# EAGLE board d-cube (EAGLE 9.2.1)
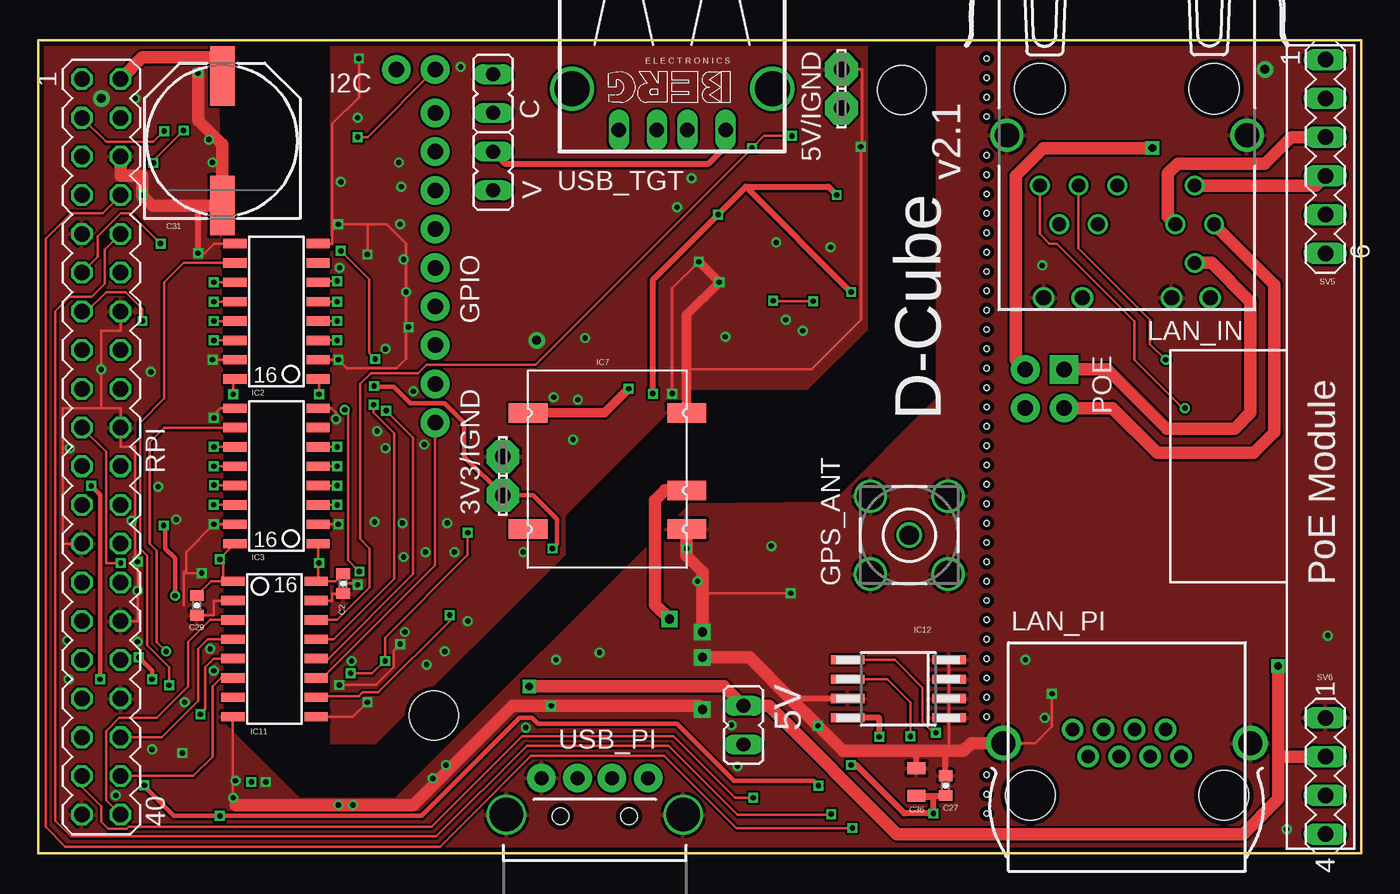
[diagram p4: board, top side]
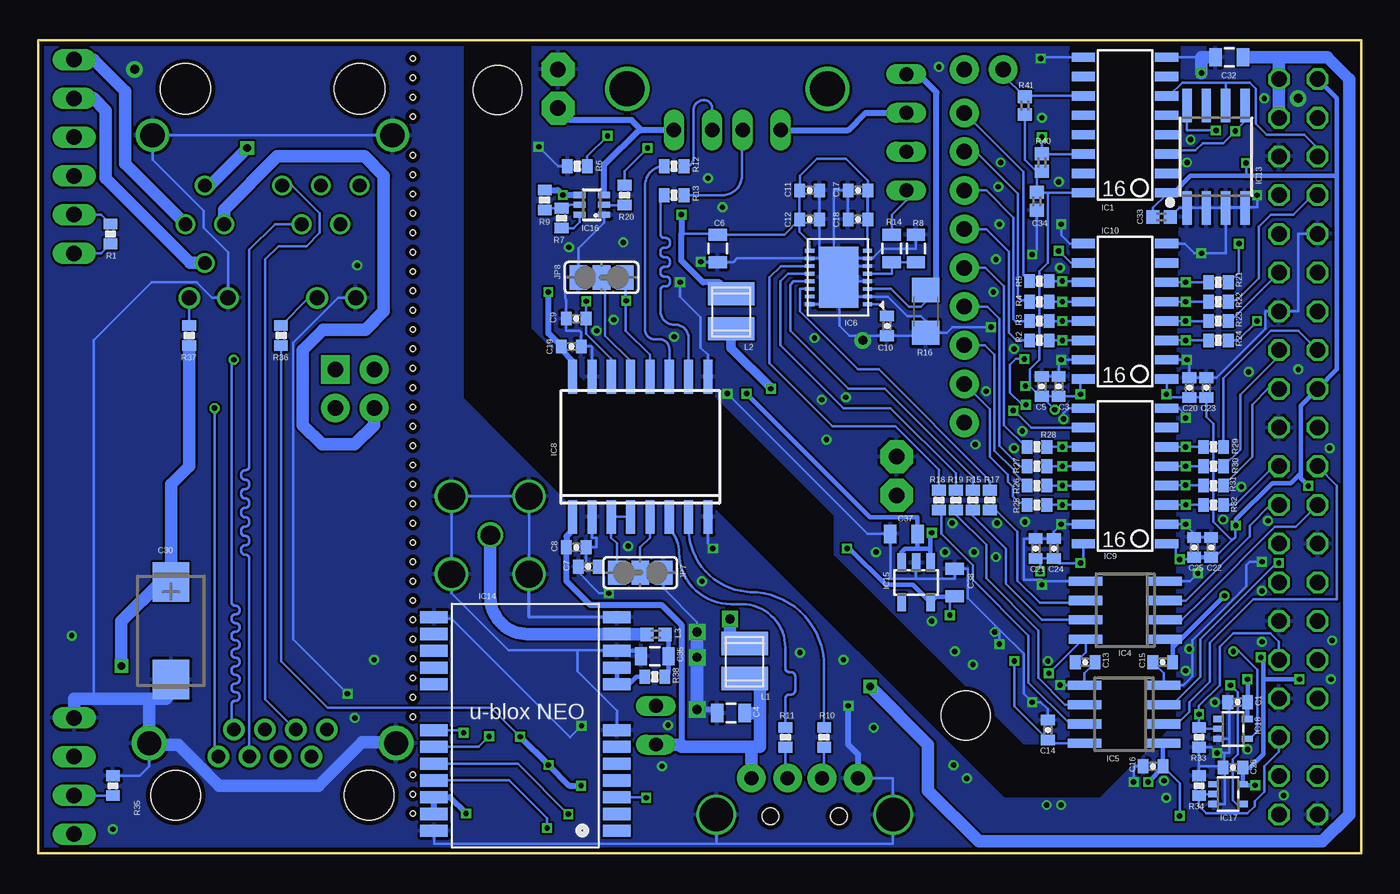
[diagram p5: board, bottom side, seen from below]

Size 86.82 x 53.33 mm. Coordinates in mm from the lower left corner, seen from the top.
Outline: 0,0 86.82,0 86.82,53.33 0,53.33 0,0
Copper layers (1*16): Top 0.035mm / dielectric 1.5mm / Bottom 0.035mm
Design rules "PCB-POOL Standard": minimum track width 0.15mm, minimum drill 0.3mm, track to track 0.15mm, track to pad 0.15mm, pad to pad 0.15mm, via to via 0.15mm, smd to smd 0.15mm, copper to edge 0.3mm, drill to drill 0.2mm, minimum pad ring 0.2mm, minimum via ring 0.15mm, stop-mask expansion 0.075mm, vias tented up to drill 0mil, thermal gap 0.2mm
Holes 3.2 mm at 56.67,50.09 25.96,9.05
Holes 0.35 mm at 62.23,36.91 62.23,38.18 62.23,39.45 62.23,40.72 62.23,41.99 62.23,43.26 62.23,44.53 62.23,45.8 62.23,48.34 62.23,49.61 62.23,50.88 62.23,52.15 62.23,35.64 62.23,34.37 62.23,33.1 62.23,31.83 62.23,30.56 62.23,29.29 62.23,28.02 62.23,26.75 62.23,25.48 62.23,24.21 62.23,22.94 62.23,21.67 62.23,20.4 62.23,19.13 62.23,17.86 62.23,16.59 62.23,15.32 62.23,14.05 62.23,12.78 62.23,11.51 62.23,10.24 62.23,8.97 62.23,5.16 62.23,3.89 62.23,2.62

## Footprints (pad centres in the part's own frame; a part is rotated, then mirrored left to right if it is on the bottom)
JP1 = drill 0.914 long: 1 0,-1.27; 2 0,1.27
0402-CAP = smd 0.7 x 0.9: 1 -0.65,0; 2 0.65,0
0805 = smd 0.8 x 1.2: 1 -0.9,0; 2 0.9,0
CT7343 = smd 2.6 x 2.4: + -3.2,0; - 3.2,0
PANASONIC_G = smd 3.9 x 1.6: + 4.25,0; - -4.25,0
0402 = smd 0.85 x 0.9: 1 -0.58,0; 2 0.58,0
1X09_NO_SILK = drill 1.016 pad 1.88: 1 0,0; 2 2.54,0; 3 5.08,0; 4 7.62,0; 5 10.16,0; 6 12.7,0; 7 15.24,0; 8 17.78,0; 9 20.32,0
BU-SMA-V = drill 1.27: 1 0,0 | drill 1.778: 2 -2.55,2.55; 3 2.55,2.55; 4 2.55,-2.55; 5 -2.55,-2.55
1X02_NO_SILK = drill 1.016 pad 1.88: 1 0,0; 2 2.54,0
SO-16 = smd 0.61 x 1.524: 1 -4.445,-2.794; 2 -3.175,-2.794; 3 -1.905,-2.794; 4 -0.635,-2.794; 5 0.635,-2.794; 6 1.905,-2.794; 7 3.175,-2.794; 8 4.445,-2.794; 9 4.445,2.667; 10 3.175,2.667; 11 1.905,2.667; 12 0.635,2.667; 13 -0.635,2.667; 14 -1.905,2.667; 15 -3.175,2.667; 16 -4.445,2.667
SO-08 = smd 0.6 x 2.2: 1 -1.905,-2.6; 2 -0.635,-2.6; 3 0.635,-2.6; 4 1.905,-2.6; 5 1.905,2.6; 6 0.635,2.6; 7 -0.635,2.6; 8 -1.905,2.6
WSON-16 = smd 0.25 x 0.6: 1 -1.75,-1.9; 2 -1.25,-1.9; 3 -0.75,-1.9; 4 -0.25,-1.9; 5 0.25,-1.9; 6 0.75,-1.9; 7 1.25,-1.9; 8 1.75,-1.9; 9 1.75,1.9; 10 1.25,1.9; 11 0.75,1.9; 12 0.25,1.9; 13 -0.25,1.9; 14 -0.75,1.9; 15 -1.25,1.9; 16 -1.75,1.9 | smd 4 x 2.6: 17 0,0
NXE2 = smd 1.27 x 2.54: 1 2.54,0; 3 5.08,0; 7 10.16,0; 8 10.16,10.414; 14 2.54,10.414
SO-16W = smd 0.6 x 2.2: 1 -4.445,-4.6; 2 -3.175,-4.6; 3 -1.905,-4.6; 4 -0.635,-4.6; 5 0.635,-4.6; 6 1.905,-4.6; 7 3.175,-4.6; 8 4.445,-4.6; 9 4.445,4.6; 10 3.175,4.6; 11 1.905,4.6; 12 0.635,4.6; 13 -0.635,4.6; 14 -1.905,4.6; 15 -3.175,4.6; 16 -4.445,4.6
SO-08M = smd 0.6 x 2.2: 1 -1.905,-3.33; 2 -0.635,-3.33; 3 0.635,-3.33; 4 1.905,-3.33; 5 1.905,3.33; 6 0.635,3.33; 7 -0.635,3.33; 8 -1.905,3.33
SO08-EIAJ = smd 0.61 x 2.21: 1 -1.905,-3.378; 2 -0.635,-3.378; 3 0.635,-3.378; 4 1.905,-3.378; 5 1.905,3.353; 6 0.635,3.353; 7 -0.635,3.353; 8 -1.905,3.353
NEO-M8 = smd 1.8 x 0.8: 1 6.4,-7.4; 2 6.4,-6.3; 3 6.4,-5.2; 4 6.4,-4.1; 5 6.4,-3; 6 6.4,-1.9; 7 6.4,-0.8; 8 6.4,2.2; 9 6.4,3.3; 10 6.4,4.4; 11 6.4,5.5; 12 6.4,6.6; 13 -5.6,6.6; 14 -5.6,5.5; 15 -5.6,4.4; 16 -5.6,3.3; 17 -5.6,2.2; 18 -5.6,-0.8; 19 -5.6,-1.9; 20 -5.6,-3; 21 -5.6,-4.1; 22 -5.6,-5.2; 23 -5.6,-6.3; 24 -5.6,-7.4
SOT23-5-DBV = smd 0.55 x 1.2: 1 -0.95,-1.3; 2 0,-1.3; 3 0.95,-1.3; 4 0.95,1.3; 5 -0.95,1.3
SOT-363 = smd 0.4 x 0.8: 1 -0.65,-0.8; 2 0,-0.8; 3 0.65,-0.8; 4 0.65,0.8; 5 0,0.8; 6 -0.65,0.8
SOT353 = smd 0.42 x 0.7: 1 -0.65,-0.95; 2 0,-0.95; 3 0.65,-0.95; 4 0.65,0.95; 5 -0.65,0.95
PAD-JUMPER-3-2OF3_NC_BY_TRACE_YES_SILK_LARGE = smd 1.168 x 1.6: 1 -1.524,0; 2 0,0; 3 1.524,0
8200 = smd 3.05 x 1.52: P$1 1.525,0.76; P$2 1.525,3.05
POE = drill 0.9 pad 1.3: 1 5.715,0; 2 4.445,2.54; 3 3.175,0; 4 1.905,2.54; 5 0.635,0; 8 -3.175,2.54; 9 -4.445,0; 10 -5.715,2.54; 11 -4.445,5.08 | drill 1 pad 1.422: G+ -5.465,7.37; G- -2.925,7.37; Y+ 2.925,7.37; Y- 5.465,7.37 | drill 1.6 pad 2.184: M1 -7.875,-3.3; M2 7.875,-3.3 | hole 3.3: 5.715,-6.35; -5.715,-6.35
0446200002 = drill 0.889 pad 1.422: 1 3.556,2.54; 2 2.54,4.318; 3 1.524,2.54; 4 0.508,4.318; 5 -0.508,2.54; 6 -1.524,4.318; 7 -2.54,2.54; 8 -3.556,4.318 | drill 1.575 pad 2.286: S@1 -8.103,3.429; S@2 8.103,3.429 | hole 3.251: 6.35,0; -6.35,0
2X02_NO_SILK = drill 1.016 pad 1.88 square: 1 0,0 | drill 1.016 pad 1.88: 2 2.54,0; 3 0,-2.54; 4 2.54,-2.54
0402-RES = smd 0.7 x 0.9: 1 -0.65,0; 2 0.65,0
1206 = smd 1.6 x 1.8: 1 -1.4,0; 2 1.4,0
MA20-2 = drill 1.016 octagon: 1 -24.13,-1.27; 2 -24.13,1.27; 3 -21.59,-1.27; 4 -21.59,1.27; 5 -19.05,-1.27; 6 -19.05,1.27; 7 -16.51,-1.27; 8 -16.51,1.27; 9 -13.97,-1.27; 10 -13.97,1.27; 11 -11.43,-1.27; 12 -11.43,1.27; 13 -8.89,-1.27; 14 -8.89,1.27; 15 -6.35,-1.27; 16 -6.35,1.27; 17 -3.81,-1.27; 18 -3.81,1.27; 19 -1.27,-1.27; 20 -1.27,1.27; 21 1.27,-1.27; 22 1.27,1.27; 23 3.81,-1.27; 24 3.81,1.27; 25 6.35,-1.27; 26 6.35,1.27; 27 8.89,-1.27; 28 8.89,1.27; 29 11.43,-1.27; 30 11.43,1.27; 31 13.97,-1.27; 32 13.97,1.27; 33 16.51,-1.27; 34 16.51,1.27; 35 19.05,-1.27; 36 19.05,1.27; 37 21.59,-1.27; 38 21.59,1.27; 39 24.13,-1.27; 40 24.13,1.27
MA06-1 = drill 1.016 long: 1 -6.35,0; 2 -3.81,0; 3 -1.27,0; 4 1.27,0; 5 3.81,0; 6 6.35,0
MA04-1 = drill 1.016 long: 1 -3.81,0; 2 -1.27,0; 3 1.27,0; 4 3.81,0
LSP10 = drill 1.016 pad 2.159 octagon: MP 0,0
USB-A-H = drill 0.914 pad 1.88: D+ 2.4,1.127; D- 2.4,-1.127; GND 2.4,3.5; VBUS 2.4,-3.5 | drill 2.2: GND2 0,-5.8; GND3 0,5.8 | hole 1.1: -0.1,2.25; -0.1,-2.25
PN87520-S = drill 0.95 long: 1 -3.5,2.71; 2 -1,2.71; 3 1,2.71; 4 3.5,2.71 | drill 2.3 pad 2.9: S1 -6.57,0; S2 6.57,0

## Placement (x,y rotation side)
5V  [JP1]  46.28,8.41 180 top
C  [JP1]  29.84,49.85 0 top
C1  0.1u  [0402-CAP]  8.1,9.92 180 bottom
C2  0.1u  [0402-CAP]  20,17.7 270 top
C3  0.1u  [0402-CAP]  19.84,30.64 90 bottom
C4  4u7  [0805]  41.35,9.21 180 bottom
C5  0.1u  [0402-CAP]  20.95,30.64 90 bottom
C6  10u  [0805]  42.23,39.69 270 bottom
C7  0.1u  [0402-CAP]  50.72,18.81 180 bottom
C8  0.1u  [0402-CAP]  51.51,20.08 0 bottom
C9  0.1u  [0402-CAP]  51.51,35.08 180 bottom
C10  1u  [0402-CAP]  31.11,34.61 270 bottom
C11  0.1u  [0402-CAP]  36.2,43.5 0 bottom
C12  10p  [0402-CAP]  36.2,41.59 0 bottom
C13  0.1u  [0402-CAP]  18.1,12.54 0 bottom
C14  0.1u  [0402-CAP]  20.56,8.1 90 bottom
C15  0.1u  [0402-CAP]  13.02,12.54 180 bottom
C16  0.1u  [0402-CAP]  13.65,5.71 180 bottom
C17  0.1u  [0402-CAP]  33.02,43.5 180 bottom
C18  10p  [0402-CAP]  33.02,41.59 180 bottom
C19  0.1u  [0402-CAP]  51.83,33.26 0 bottom
C20  0.1u  [0402-CAP]  11.27,30.56 90 bottom
C21  0.1u  [0402-CAP]  21.35,20 90 bottom
C22  0.1u  [0402-CAP]  9.84,20.08 90 bottom
C23  0.1u  [0402-CAP]  10.16,30.56 90 bottom
C24  0.1u  [0402-CAP]  20.16,20 90 bottom
C25  0.1u  [0402-CAP]  10.95,20.08 90 bottom
C26  0.1u  [0402-CAP]  8.41,5.64 180 bottom
C27  0.1u  [0402-CAP]  59.53,4.45 90 top
C29  0.1u  [0402-CAP]  10.4,16.27 270 top
C30  470u  [CT7343]  78.11,14.61 270 bottom
C31  1000uF  [PANASONIC_G]  12.06,46.75 90 top
C32  0.1u  [0805]  8.65,52.23 180 bottom
C33  0.1uF  [0402]  13.1,41.75 0 bottom
C34  0.1uF  [0402]  21.27,42.78 270 bottom
C35  10n  [0805]  46.35,12.94 180 bottom
C36  10uF  [0805]  57.63,4.68 90 top
C37  1.0uF  [0805]  30,20.95 180 bottom
C38  1.0uF  [0805]  26.67,17.78 90 bottom
GPIO  [1X09_NO_SILK]  26.04,48.58 270 top
GPS_ANT  BU-SMA-V  [BU-SMA-V]  57.15,20.88 0 top
I2C  [1X02_NO_SILK]  23.5,51.44 0 top
IC1  SI8605  [SO-16]  15.56,47.78 90 bottom
IC2  SI8640AB-B-IS1  [SO-16]  15.56,35.56 90 top
IC3  SI8640AB-B-IS1  [SO-16]  15.56,24.77 90 top
IC4  ISO7220M  [SO-08]  15.48,15.95 90 bottom
IC5  ISO7221M  [SO-08]  15.56,9.13 90 bottom
IC6  [WSON-16]  34.29,37.78 90 bottom
IC7  NXE2  [NXE2]  42.55,18.73 90 top
IC8  ADUM3160  [SO-16W]  47.31,26.67 0 bottom
IC9  SI8640AB-B-IS1  [SO-16]  15.56,24.77 90 bottom
IC10  SI8640AB-B-IS1  [SO-16]  15.56,35.56 90 bottom
IC11  SI8640AB-B-IS1  [SO-16]  15.56,13.41 270 top
IC12  24AA32ASM  [SO-08M]  56.44,10.79 90 top
IC13  I2C EEPROM  [SO08-EIAJ]  9.53,45.72 0 bottom
IC14  NEO-M8  [NEO-M8]  55.24,8.89 0 bottom
IC15  MIC550X-YM5  [SOT23-5-DBV]  29.21,17.78 180 bottom
IC16  COMPLEMENTARY  [SOT-363]  50.48,42.55 90 bottom
IC17  74LVC1G04  [SOT353]  8.73,3.89 270 bottom
IC18  74LVC1G04  [SOT353]  8.41,8.18 270 bottom
JP7  JUMPER-PAD-3-2OF3_NC_BY_TRACE_LARGE  [PAD-JUMPER-3-2OF3_NC_BY_TRACE_YES_SILK_LARGE]  47.31,18.41 180 bottom
JP8  JUMPER-PAD-3-2OF3_NC_BY_TRACE_LARGE  [PAD-JUMPER-3-2OF3_NC_BY_TRACE_YES_SILK_LARGE]  49.85,37.78 0 bottom
L1  820082153C  [8200]  41.99,10.72 0 bottom
L2  820082223C  [8200]  42.86,33.66 0 bottom
L3  27nH  [0402]  46.28,14.37 0 bottom
LAN_IN  SI-52008-F  [POE]  71.44,43.81 180 top
LAN_PI  0446200002  [0446200002]  71.44,3.81 0 top
POE  [2X02_NO_SILK]  67.31,31.75 270 top
R1  10k  [0402-RES]  82.07,40.64 90 bottom
R2  100k  [0402-RES]  21.11,33.66 180 bottom
R3  100k  [0402-RES]  21.11,34.92 180 bottom
R4  100k  [0402-RES]  21.11,36.2 180 bottom
R5  100k  [0402-RES]  21.11,37.54 180 bottom
R6  10k  [0402-RES]  51.44,45.09 0 bottom
R7  10k  [0402-RES]  52.47,41.67 90 bottom
R8  10k  [0805]  29.21,39.69 270 bottom
R9  100k  [0402-RES]  53.58,42.86 90 bottom
R10  24  [0402-RES]  35.24,7.62 270 bottom
R11  24  [0402-RES]  37.78,7.62 270 bottom
R12  24  [0402-RES]  45.09,45.09 0 bottom
R13  24  [0402-RES]  45.09,43.18 0 bottom
R14  46k4  [0805]  30.8,39.69 90 bottom
R15  33  [0402-RES]  25.48,23.18 270 bottom
R16  0.51  [1206]  28.57,35.56 90 bottom
R17  33  [0402-RES]  24.37,23.18 270 bottom
R18  33  [0402-RES]  27.7,23.18 270 bottom
R19  33  [0402-RES]  26.59,23.18 270 bottom
R20  100  [0402-RES]  48.34,43.18 270 bottom
R21  100  [0402-RES]  9.37,37.47 0 bottom
R22  100  [0402-RES]  9.37,36.2 0 bottom
R23  100  [0402-RES]  9.37,34.92 0 bottom
R24  100  [0402-RES]  9.37,33.66 0 bottom
R25  100k  [0402-RES]  21.27,22.86 180 bottom
R26  100k  [0402-RES]  21.27,24.13 180 bottom
R27  100k  [0402-RES]  21.27,25.4 180 bottom
R28  100k  [0402-RES]  21.27,26.67 180 bottom
R29  100  [0402-RES]  9.68,26.67 0 bottom
R30  100  [0402-RES]  9.68,25.4 0 bottom
R31  100  [0402-RES]  9.68,24.13 0 bottom
R32  100  [0402-RES]  9.68,22.86 0 bottom
R33  10k  [0402-RES]  10.64,7.62 90 bottom
R34  10k  [0402-RES]  10.64,4.45 270 bottom
R35  100k  [0402-RES]  81.92,4.45 90 bottom
R36  220  [0402-RES]  70.88,33.97 90 bottom
R37  470  [0402-RES]  76.91,33.97 90 bottom
R38  10  [0402-RES]  46.35,11.59 180 bottom
R40  100k  [0402]  20.95,45.32 270 bottom
R41  100k  [0402]  22.07,49.05 270 bottom
RPI  [MA20-2]  4.13,26.67 270 top
SV5  [MA06-1]  84.45,45.72 270 top
SV6  [MA04-1]  84.45,5.08 270 top
TP_3V3  LSP10  [LSP10]  30.48,23.5 90 top
TP_IGND  LSP10  [LSP10]  52.7,51.44 90 top
TP_IGND1  LSP10  [LSP10]  30.48,26.04 90 top
TP_VCC  LSP10  [LSP10]  52.7,48.9 90 top
U$1  [TU-LOGO-SMALL]  67.23,20.32 90 top
U$2  [TU-LOGO-SMALL]  67.23,20.8 270 bottom
USB_PI  USB+SHIELDUSB-A-H-S  [USB-A-H]  36.51,2.54 90 top
USB_TGT  PN87520-S  [PN87520-S]  41.59,50.16 180 top
V  [JP1]  29.84,44.77 180 top

## Tracks (layer width: path | path; a pad name or v marks a point on that pad's centre or on a via)
!EN_BLOCK1  (via drill 0.35)
  Top 0.152: v8.57,11.03 8.57,12.22 7.14,13.65 7.14,19.53 6.67,20 6.67,28.26 8.26,29.84 8.26,37.47 9.53,38.73 IC2.10
  Bottom 0.152: IC17.4 7.78,3.17 8.1,3.17 8.41,3.49 8.41,6.19 8.1,6.51 8.1,10.56 v8.57,11.03
!EN_BLOCK2  (via drill 0.35)
  Top 0.152: v8.38,13.26 7.78,13.86 7.78,19.84 7.3,20.32 7.3,26.99 8.26,27.94 IC3.10
  Bottom 0.152: IC18.4 7.32,7.53 6.83,8.02 6.83,12.06 8.02,13.26 v8.38,13.26
+3V3  (via drill 0.35)
  Top 0.152: IC3.16 11.91,19.34 v11.91,19.29 12.13,19.29 12.13,17.86 IC11.1 11.34,17.86 C29.1 | v12.78,30.12 12.78,31 IC2.16 | v9.53,47.43 7.54,45.44 v7.54,45.3
  Top 0.305: v8.97,16.91 8.97,19.37 8.33,20 8.33,21.4 v8.23,21.51 | v7.46,11.43 7.46,11.99 v6.59,12.86 | v51.2,4.45 50.88,4.76 45.64,4.76 41.91,8.49 32.78,8.49 32.38,8.89 31.59,8.89 25.16,2.46 v11.91,2.46 8.89,2.46 6.96,4.39 v6.96,4.47 | v4.05,11.43 4.05,23.53 v3.47,24.11
  Top 0.406: v55.18,7.65 55.18,8.89 IC12.8 | v53.33,5.8 53.65,5.8 56.83,2.62 v58.74,2.62 58.74,3.73 57.63,3.73 C36.1 59.52,3.78 C27.1
  Bottom 0.152: IC9.1 12.14,20.32 12.14,19.53 v11.91,19.29 11.1,19.29 C25.1 | C22.1 9.59,19.43 8.48,20.54 | 8.48,20.54 8.27,20.76 8.27,21.47 v8.23,21.51 | IC10.1 12.76,30.14 v12.78,30.12 12.56,29.91 C20.1 C23.1 10.16,28.65 9.68,28.18 9.68,21.75 8.48,20.54 | IC13.8 11.43,47.43 v9.53,47.43 | v7.54,45.3 7.54,44.53 7.62,44.45 | R36.1 70.88,12.62 67.82,9.56 57.09,9.56 v55.18,7.65 | C33.1 13.68,42.34 12.76,43.26 IC1.1 | C16.1 11.91,4.62 v11.91,2.46
  Bottom 0.305: 1.59,44.45 1.59,31.75 RPI.17 3.97,29.37 3.97,24.92 | 1.59,44.45 1.59,49.53 RPI.1 | 6.43,11.43 6.43,12.7 v6.59,12.86 | 6.43,11.43 6.43,6.51 7.3,5.64 C26.1 7.76,4.56 | IC17.5 7.76,4.56 | IC18.5 7.46,9.9 C1.1 7.45,11.41 v7.46,11.43 | C25.1 C22.1 | IC4.1 12.37,14.05 C15.1 12.37,13.51 v8.97,16.91 | v13.97,4.68 13,5.65 C16.1 13,7.18 IC5.1 | 3.97,24.92 4.6,24.29 5.84,24.29 8.23,21.91 v8.23,21.51 | 1.59,44.45 7.62,44.45 11.19,44.45 12.3,43.34 IC1.1 | v6.96,4.47 7.68,4.47 7.76,4.56 | 6.43,11.43 v4.05,11.43 | v3.47,24.11 3.97,24.61 3.97,24.92
  Bottom 0.406: v51.2,4.45 51.98,4.45 v53.33,5.8 v55.18,7.65 | IC14.23 IC14.22 59.81,3.69 v58.74,2.62
+5V  (via drill 0.5)
  Top 0.813: v32.23,10.95 45.01,10.95 5V.1 47.94,9.68 56.36,1.27 79.06,1.27 81.36,3.57 81.36,6.35 | 81.36,6.35 v81.36,12.3 | SV6.2 81.36,6.35 | RPI.2 6.83,52.23 11.79,52.23 12.06,51.95 C31.+
  Bottom 0.813: RPI.4 RPI.2 5.4,52.15 5.32,52.23 | 5.32,52.23 2.22,52.23 0.79,50.8 0.79,2.54 2.54,0.79 25.08,0.79 28.42,4.13 28.42,7.14 v32.23,10.95 | v81.36,12.3 81.36,15.24 78.79,17.8 C30.+ 78.11,24.21 76.91,25.4 R37.1 | 5.32,52.23 C32.1
A_CSB
  Bottom 0.152: IC6.14 36.83,37.03 36.83,35.56 33.02,31.75 31.66,31.75 24.37,24.46 R17.1
A_SCLK
  Bottom 0.152: IC6.13 37.24,37.53 37.47,37.31 37.47,34.29 33.66,30.48 31.26,30.48 25.48,24.7 R15.1
A_SDI
  Bottom 0.152: IC6.12 37.61,38.03 38.1,37.54 38.1,33.34 33.97,29.21 30.88,29.21 26.59,24.92 R19.1
A_SDO
  Bottom 0.152: IC6.11 38.06,38.53 38.81,37.78 38.81,32.15 34.69,28.02 30.56,28.02 27.7,25.16 R18.1
B1C1  (via drill 0.35)
  Top 0.152: RPI.11 3.89,39.13 3.89,40.48 5.4,41.99 6.03,41.99 v8.02,40.01
  Bottom 0.152: R21.2 8.64,37.47 8.02,38.09 v8.02,40.01
B1C2
  Bottom 0.152: RPI.7 3.17,43.18 4.46,41.89 5.94,41.89 6.73,41.11 6.73,37.72 8.16,36.29 8.72,36.29 R22.2
B1C3
  Bottom 0.152: RPI.12 8.57,34.92 R23.2
B1C4  (via drill 0.35)
  Top 0.152: RPI.13 3.17,35.56 4.45,36.83 5.71,36.83 6.83,35.72 v6.83,34.92
  Bottom 0.152: R24.2 8.1,33.66 v6.83,34.92
B2C1
  Bottom 0.152: RPI.15 4.13,34.29 5.92,34.29 9.03,31.18 R29.2
B2C2
  Bottom 0.152: RPI.16 5.4,32.62 7.94,30.08 7.94,26.5 R30.2
B2C3
  Bottom 0.152: R31.2 7.14,26.02 7.14,29.45 6.11,30.48 RPI.18
B2C4
  Bottom 0.152: RPI.22 5.71,25.4 8.26,22.86 R32.2
BSCL
  Bottom 0.152: IC1.11 22.01,49.69 R41.1 23.5,51.06 I2C.1
BSDA  (via drill 0.35)
  Top 0.152: I2C.2 21.59,46.99 v20.95,46.99
  Bottom 0.152: IC1.14 20.93,45.88 R40.1 v20.95,46.99
CP1
  Bottom 0.152: SV5.5 82.69,41.91 R1.2
CP2
  Bottom 0.152: SV5.6 82.69,39.37 R1.1
CSB
  Bottom 0.152: IC4.3 11.51,16.59 7.3,20.8 7.3,21.51 5.95,22.86 RPI.24
D+_OUT
  Bottom 0.152: R13.1 45.98,42.93 45.98,40.64 arc-90 45.72,40.38 45.63,40.38 arc90 45.36,40.11 45.36,40.01 arc90 45.63,39.74 45.72,39.74 arc-90 45.98,39.48 45.98,39.37 arc-90 45.72,39.11 45.63,39.11 arc90 45.36,38.85 45.36,38.74 arc90 45.63,38.48 45.72,38.48 arc-90 45.98,38.21 45.98,38.11 arc-90 45.72,37.84 45.63,37.84 arc90 45.36,37.58 45.36,37.47 arc90 45.63,37.21 45.72,37.21 arc-90 45.98,36.95 45.98,35.59 arc-90 45.09,34.69 45.01,34.69 arc90 44.13,33.81 IC8.10
D+_OUT_TERM
  Bottom 0.152: USB_TGT.3 40.64,47.41 40.64,44.45 arc90 41.91,43.18 R13.2
D-_OUT
  Bottom 0.152: R12.1 arc-90 46.99,43.83 46.99,34.37 arc-90 46.35,33.73 46.04,33.73 arc90 45.4,33.1 IC8.11
D-_OUT_TERM
  Bottom 0.152: USB_TGT.2 42.59,48.9 arc-90 43.12,49.43 arc-90 43.81,48.74 43.81,45.56 arc90 44.29,45.09 R12.2
EN_BLOCK1
  Top 0.152: IC11.4 11.11,14.05 10.48,13.41 10.48,10 8.1,7.62 RPI.36
  Bottom 0.152: IC17.2 10.54,3.89 R34.2 10.64,3.1 10.16,2.62 7.46,2.62 6.99,3.1 6.99,3.41 6.35,4.05 6.35,5.71 5.4,6.67 RPI.36
EN_BLOCK2  (via drill 0.35)
  Top 0.152: IC11.5 11.51,12.78 10.95,12.22 10.95,9.45 v10.64,9.13
  Bottom 0.152: IC18.2 10.54,8.18 R33.2 v10.64,9.13 10.64,9.68 9.29,11.03 9.29,13.56 8.4,14.45 5.95,14.45 5.4,13.89 RPI.32
GND  (via drill 0.35, 0.6)
  Top 0.152: 4.13,29.21 5.4,29.21 RPI.20 5.4,26.67 6.35,26.67 6.35,19.29 v6.51,19.13 6.51,15.24 RPI.30 | 4.13,29.21 1.59,29.21 1.59,20.32 RPI.25 | v11.51,28.57 11.51,28.78 11.94,29.21 IC3.9 | 4.13,29.21 4.13,34.29 5.4,34.29 RPI.14 | IC3.15 v11.51,21.59 9.68,19.76 9.68,18.39 v10.72,18.39 | IC2.9 11.54,40.01 10.91,39.37 v10.48,39.37 | v11.43,32.38 IC2.15 | v66.52,10.48 66.52,8.33 65.42,7.24 LAN_PI.S@1 | IC12.4 IC12.3 IC12.2 IC12.1 59.77,6.74 | v49.37,17.07 43.58,17.07 | 9.53,18.49 9.53,16.27 | 12,16.59 IC11.2 11.51,16.59 11.51,15.62 C29.2 | IC11.8 12.76,3.17 12.94,3.17
  Top 0.406: IC12.7 49.37,10.16 | v10.48,39.37 10.48,42.18 10.79,42.5 | C36.2 57.63,6.74 | C27.2 59.53,6.58 59.37,6.74
  Top 0.813: 12.94,3.17 24.61,3.17 31.11,9.68 v33.66,9.68 43.34,9.68 v43.58,9.45 | RPI.6 5.4,44.45 6.83,44.45 v6.83,43.18 7.5,42.5 10.79,42.5 C31.- 12.06,46.51 10.48,48.1 v10.48,51.2 | IC7.1 v42.55,20 42.55,19.53 43.58,18.49 43.58,17.07 v43.58,14.53 | LAN_PI.S@1 61.22,7.24 60.72,6.74 59.77,6.74 59.37,6.74 57.63,6.74 52.79,6.74 v51.16,8.37 49.37,10.16 46.67,12.86 v43.58,12.86
  Bottom 0.152: v6.51,19.13 7.3,19.13 7.54,18.89 7.54,17.54 11.08,14 11.08,11.62 11.67,11.03 IC5.4 12.96,11.83 C15.2 | 42.31,0.64 30.71,0.64 USB_PI.GND3 30.71,4.94 USB_PI.GND | USB_PI.GND2 42.31,0.64 | RPI.9 4.13,40.64 4.13,35.56 RPI.14 6.28,35.56 6.28,34.43 9.49,31.21 C23.2 C20.2 11.27,32.23 v11.43,32.38 IC10.2 | 10.64,5.71 R33.1 9.83,6.97 v9.45,6.59 8.97,6.59 | IC9.8 11.97,29.21 11.51,28.75 v11.51,28.57 | LAN_IN.M2 LAN_IN.M1 79.31,45.5 75.96,42.15 75.96,41.04 74.36,39.44 LAN_IN.G- 75.39,36.45 76.41,37.47 79.38,37.47 83.19,33.66 83.19,10.16 | C22.2 C25.2 10.95,20.97 11.57,21.59 IC9.2 v11.51,21.59 | 63.4,7.3 LAN_PI.S@1 | LAN_PI.S@2 79.54,6.55 79.53,6.55 | 79.53,6.55 79.53,5.71 80.15,5.09 R35.2 | 79.53,7.14 79.53,6.55 | 10.64,5.71 R34.1 | IC17.3 8.95,3.24 8.95,5.64 C26.2 | C26.2 9.14,5.71 10.64,5.71 | C1.2 8.65,9.83 8.65,7.54 | 8.65,7.54 8.65,6.59 8.97,6.59 | 8.89,5.65 8.88,5.64 | IC18.3 8.67,7.53 8.65,7.54 | C16.2 14.92,5.71 v14.92,4.68 | IC10.8 11.57,40.01 10.94,39.37 v10.48,39.37 8.89,39.37 IC13.3 | IC13.4 IC13.3 | IC13.3 IC13.2 IC13.1 11.93,42.34 C33.2 | IC13.3 8.89,42.39 6.83,42.39 v6.83,43.18 | LAN_IN.Y- 67.14,36.45 70.09,33.5 70.09,14.05 v66.52,10.48 | JP7.1 45.78,17.38 43.58,15.18 v43.58,14.53 | 50.4,21.99 IC8.2 50.48,20.72 50.16,20.72 50.16,20.08 C8.2 50.86,18.81 C7.2 51.37,18.43 50.01,17.07 v49.37,17.07 | 54.6,21.76 GPS_ANT.5 GPS_ANT.2 GPS_ANT.3 GPS_ANT.4 59.7,17.08 55.96,13.34 51.44,13.34 | IC14.10 48.89,13.34 51.44,13.34 | IC14.7 48.84,9.36 51.44,11.95 51.44,13.34 | IC1.8 C32.2 | 42.31,0.64 60.84,0.64 IC14.24 | 8.97,6.59 8.97,5.64 C26.2 | IC4.4 11.25,17.86 v10.72,18.39 | IC14.13 60.75,15.4 59.69,15.4 51.91,7.62 v51.16,8.37
  Bottom 0.152: IC8.8 42.86,20.32 v42.55,20
  Bottom 0.203: IC14.12 54.6,15.49 GPS_ANT.5
  Bottom 0.305: C35.2 47.61,13.29 IC14.10
  Bottom 0.406: USB_PI.GND 33.01,6.5 33.66,7.14 v33.66,9.68 | v43.58,9.45 42.49,9.45 C4.2
  Bottom 0.813: 79.54,10.16 78.42,10.16 78.11,10.48 C30.- | LAN_PI.S@2 79.54,10.16 | SV6.1 84.45,10.16 83.19,10.16 79.54,10.16 | 79.53,7.14 77.63,7.14 74.93,4.45 68.42,4.45 65.56,7.3 63.4,7.3 | v43.58,14.53 v43.58,12.86 v43.58,9.45 | v10.48,51.2 10.48,52.23 C32.2
  other vias: 31.99,8.26 33.97,12.7 36.83,13.18 81.92,1.59 4.13,31.75 84.61,14.29 80.49,51.44 66.04,8.89 64.77,12.7 65.88,38.58 4.13,49.53 43.26,17.86 2.06,26.59 7.86,24.05 7.38,31.59 6.51,17.22 7.46,6.83 12.78,3.65 11.19,46.83 11.43,45.32 6.35,49.53 12.94,4.76 9.05,21.91 20.64,3.17 19.68,3.17 11.27,13.41 11.51,11.99 6.11,21.83 6.51,13.89 9.6,9.92 48.1,20.16 26.75,5.79 25.88,4.92 5.08,3.81 1.98,11.43 1.91,13.97 45.88,5.71 45.48,8.41
  pour Bottom: -2.22,54.61 -2.22,-1.27 88.27,-1.27 88.27,54.77 58.98,54.77 58.98,29.84 52.13,22.99 42.75,22.91 23.42,3.57 17.14,3.57 12.06,8.65 12.06,29.53 11.73,54.61
  pour Top: -2.22,54.61 -2.22,-1.27 88.27,-1.27 88.27,54.77 58.98,54.77 58.98,29.84 52.13,23 42.75,22.91 23.42,3.57 17.14,3.57 12.06,8.65 12.06,29.53 11.73,54.61
GNDA  (via drill 0.35, 0.6)
  Top 0.152: v41.59,30.16 41.59,37.07 v43.34,38.81 | v19.53,28.5 19.53,28.91 19.23,29.21 IC3.8 | IC3.2 v19.68,21.59 | IC2.2 v19.68,32.38 20.24,31.83 23.5,31.83 24.13,32.46 24.13,34.53 | IC2.8 19.29,40.01 19.29,47.86 21.03,49.61 v21.03,52.15 | v19.68,41.27 21.59,41.27 | 21.59,41.27 22.86,41.27 24.13,40.01 24.13,34.53 | 24.13,34.53 v24.29,34.53 | v21.59,39.29 21.59,41.27 | IC7.7 42.55,31.75 50.72,31.75 53.98,35 v53.98,46.35 54.05,46.43 54.05,51.44 TP_IGND.MP | IC11.9 20.64,8.97 v21.59,9.92 | v23.73,13.73 23.3,13.3 23.3,12.2 22.15,11.05 v19.74,11.05 | IC11.15 19.29,16.59 19.29,17.05 C2.2 20,17.71 20.87,17.71 v20.95,17.63
  Top 0.61: IC7.7 42.55,35.32 v44.69,37.47 v43.34,38.81
  Bottom 0.152: IC6.6 34.29,38.53 | IC6.17 34.29,37.53 IC6.4 | 34.29,36.53 IC6.2 31.06,36.53 29.77,35.24 28.89,35.24 28.57,34.92 28.57,34.29 | 34.61,39.03 IC6.10 40.95,39.03 41.2,38.79 C6.2 43.31,38.79 v43.34,38.81 | 34.61,39.03 34.29,39.03 | 34.29,39.03 34.29,38.53 | IC6.16 34.29,36.03 34.29,36.53 | R8.1 29.21,39.67 31.44,39.67 32.07,39.03 IC6.7 34.29,39.03 | 34.29,38.53 IC6.17 | C11.2 C12.2 35.55,39.04 IC6.17 | C18.2 C17.2 34.61,43.5 34.61,39.03 | 28.57,34.29 R16.1 | 34.29,36.53 IC6.17 | v53.98,46.35 52.7,45.09 R6.1 | C5.2 C3.2 19.84,32.23 v19.68,32.38 IC10.15 | R16.1 28.57,33.97 28.02,34.53 | 28.57,34.29 28.91,33.96 C10.2 33.59,33.96 34.24,34.61 34.24,37.73 IC6.17 | C13.2 18.16,11.83 IC5.5 19.73,11.03 v19.74,11.05 | IC9.9 19.18,29.21 19.53,28.86 v19.53,28.5 | IC9.15 v19.68,21.59 20.16,21.11 C24.2 C21.2 22.15,20.65 22.15,17.94 20.95,17.94 | v19.68,41.27 19.68,40.56 19.13,40.01 IC10.9 | v21.03,52.15 20.95,52.23 IC1.9 | C34.2 21.27,39.61 v21.59,39.29 | v44.69,37.47 44.69,36.51 43.34,35.16 43.34,33.17 42.86,32.7 IC8.9 | IC8.15 50.48,33.19 50.55,33.26 C19.2 | C19.2 51.18,33.31 | IC16.1 49.68,41.38 51.37,39.69 JP8.1 52.24,37.78 52.24,36.43 52.16,36.35 C9.2 52.16,34.29 51.28,34.29 51.18,34.2 C19.2 | 29.21,18.02 26.67,18.02 C38.2 25.8,18.68 25.8,16.75 23.73,14.68 | 29.21,18.02 IC15.2 | 29.21,18.02 30.88,18.02 30.88,20.93 C37.2 32.38,20.95 v41.59,30.16 | C14.2 20.56,9.45 21.03,9.92 v21.59,9.92 22.15,10.48 22.15,13.1 23.73,14.68 | v20.95,17.63 20.95,17.94 | v23.73,13.73 23.73,14.68 | IC4.5 20.87,17.86 20.95,17.94 | R16.1 27.2,34.16 26.83,34.53 v24.29,34.53
  other vias: 27.7,51.59 41.91,42.39 32.7,33.66 42.86,44.29 35.08,27.15 35.88,33.81 33.81,29.92 49.05,35 50.16,34.29 35.4,29.77 22.78,26.59 22.23,27.7 20.95,48.26 19.84,44.05 45.09,33.89 26.83,21.67 23.81,43.74 23.73,41.27 23.97,38.97 24.13,36.83 23.65,45.32 19.76,38.42 25.48,12.38 28.18,15.24 26.67,13.26 22.07,21.75 31.83,19.76 23.89,21.67 23.97,19.45 25.4,19.76 24.05,14.53 27.3,19.76 20.56,12.62 22.78,33.1 48.42,40.08 51.99,39.77 24.61,30.32 25.32,26.83
  pour Bottom: 19.21,54.61 54.37,54.61 54.37,34.45 50.4,30.48 42.86,30.48 34.53,22.15 34.53,19.61 22.15,7.22 19.21,7.22
  pour Top: 19.21,54.61 54.37,54.61 54.37,34.37 50.48,30.48 42.86,30.48 34.53,22.15 34.53,19.61 22.15,7.22 19.21,7.22
GPS_SIG
  Bottom 0.305: 46.88,14.39 L3.1
  Bottom 0.813: 46.88,14.39 IC14.11 54.71,14.39 arc90 57.15,16.83 GPS_ANT.1
GSCL  (via drill 0.35)
  Top 0.152: IC12.6 55.72,11.43 57.23,9.92 v57.23,7.68
  Bottom 0.152: IC14.19 57.92,6.99 v57.23,7.68
GSDA  (via drill 0.35)
  Top 0.152: v58.9,7.92 58.74,7.92 58.02,8.63 58.02,10.87 56.2,12.7 IC12.5
  Bottom 0.152: IC14.18 59.07,8.09 v58.9,7.92
I_B1C1
  Bottom 0.152: R2.2 22.62,33.66 23.13,34.16 23.13,39.48 24.61,40.96 | GPIO.4 24.61,40.96 | 24.61,40.96
I_B1C2
  Bottom 0.152: GPIO.3 24.61,43.5 22.83,41.72 22.83,35.05 22.7,34.92 R3.2
I_B1C3
  Bottom 0.152: R4.2 21.84,36.27 22.3,36.27 22.52,36.49 22.52,43.28 25.28,46.04 GPIO.2
I_B1C4
  Bottom 0.152: GPIO.1 22.16,44.7 22.16,37.94 R5.2
I_B2C1
  Bottom 0.152: R25.2 21.92,23.02 22.46,23.02 22.86,23.42 22.86,24.05 23.18,24.37 23.18,24.84 24.37,26.04 24.37,29.13 GPIO.8
I_B2C2
  Bottom 0.152: GPIO.7 24.69,33.34 24.05,32.7 24.05,26.43 22.8,25.18 22.8,25 R26.2
I_B2C3
  Bottom 0.152: R27.2 22.4,25.4 23.73,26.73 23.73,35.08 24.53,35.88 GPIO.6
I_B2C4
  Bottom 0.152: R28.2 22,26.67 23.43,28.1 23.43,37.21 24.64,38.42 GPIO.5
I_EN_BLOCK1  (via drill 0.35)
  Top 0.152: IC11.13 19.37,14.05 23.34,18.02 23.34,27.58 22,28.91 v22,29.43 | v19.84,39.53 21.7,37.67 21.7,32.83 v22.1,32.44
  Bottom 0.152: IC10.10 19.05,38.73 v19.84,39.53 | v22.1,32.44 22.66,32.44 23.04,32.06 23.04,30.23 22.24,29.43 v22,29.43
I_EN_BLOCK2  (via drill 0.35)
  Top 0.152: IC11.12 19.05,12.78 24.61,18.34 24.61,27.28 v22.83,29.05
  Bottom 0.152: IC9.10 21.64,27.94 22.75,29.05 v22.83,29.05
I_PWR_SW  (via drill 0.35)
  Top 0.152: v49.45,47.07 47.62,47.07 v46.83,46.28 32.62,32.07 25.48,32.07 24.92,31.51 21.83,31.51 21.11,30.8 21.11,20.64 21.75,20 21.75,17.46 19.61,15.32 IC11.14
  Bottom 0.152: R6.2 50.78,45.72 49.45,47.05 v49.45,47.07 | R20.1 48.34,44.77 v46.83,46.28
I_RST_SW
  Top 0.152: GPIO.9 26.04,18.89 18.65,11.51 IC11.11
INCP
  Bottom 0.152: IC6.3 30.84,37.03 29.69,35.88 28.89,35.88 28.57,36.2 R16.2
  Bottom 0.406: R16.2 27.86,37.67 27.86,49.93 29.05,51.12 C.2
INVP
  Bottom 0.152: IC6.5 30.8,38.03 R14.1 R8.2
MISO
  Bottom 0.152: RPI.21 1.59,24.13 1.59,16.67 7.06,16.67 9.92,13.81 9.92,11.27 11.27,9.92 11.27,9.29 12.06,8.49 IC5.2
MOSI  (via drill 0.35)
  Top 0.152: RPI.19 4.45,26.35 4.45,19.05 v5.4,19.05
  Bottom 0.152: v5.4,19.05 5.56,19.05 10.56,14.05 10.56,11.59 12.38,9.76 IC5.3
N$1  (via drill 0.6)
  Top 0.813: IC7.3 41.12,23.81 40.48,23.18 40.48,16.32 v41.42,15.38
  Bottom 0.813: v41.42,15.38 41.42,14.19 41.1,13.87 40.57,13.87 L1.P$2
N$2  (via drill 0.35)
  Top 0.152: IC2.3 v19.61,33.66
  Bottom 0.152: IC10.14 v19.61,33.66 R2.1
N$3
  Bottom 0.152: IC16.2 49.67,42.53 R20.2
N$4
  Bottom 0.152: IC16.5 51.93,42.55 52.15,42.32 R7.2 53.47,42.32 R9.1
N$5  (via drill 0.35)
  Top 0.61: v38.73,30.48 37.15,28.89 IC7.8
  Bottom 0.61: L2.P$1 41.34,33.15 38.73,30.54 v38.73,30.48
N$6  (via drill 0.35)
  Top 0.152: IC2.14 v11.51,33.66
  Bottom 0.152: R24.1 v11.51,33.66 IC10.3
N$7  (via drill 0.35)
  Top 0.152: IC2.13 v11.51,34.92
  Bottom 0.152: IC10.4 v11.51,34.92 R23.1
N$8
  Bottom 0.152: R7.1 51.67,41.02 51.28,41.41 IC16.6
N$9
  Bottom 0.152: R36.2 69.06,36.45 LAN_IN.Y+
N$10
  Bottom 0.152: R37.2 76.91,36.43 LAN_IN.G+
N$11  (via drill 0.35)
  Top 0.152: IC2.12 v11.51,36.2
  Bottom 0.152: IC10.5 v11.51,36.2 R22.1
N$12  (via drill 0.35)
  Top 0.152: IC3.3 v19.61,22.86
  Bottom 0.152: IC9.14 v19.61,22.86 R25.1
N$13  (via drill 0.35)
  Top 0.152: v19.61,37.54 18.43,37.54 IC2.6
  Bottom 0.152: IC10.11 18.3,37.54 v19.61,37.54 R5.1
N$14  (via drill 0.35)
  Top 0.152: IC2.5 v19.61,36.2
  Bottom 0.152: IC10.12 v19.61,36.2 R4.1
N$15  (via drill 0.35)
  Top 0.152: IC2.4 v19.61,34.92
  Bottom 0.152: IC10.13 v19.61,34.92 R3.1
N$16
  Bottom 0.152: IC6.1 31.64,36.03 31.11,35.51 C10.1
N$17
  Bottom 0.152: IC4.7 20.94,15.32 23.32,17.7 23.32,19.99 25.48,22.15 R15.2
N$18
  Bottom 0.152: IC4.6 18.24,16.43 21.09,16.43 22.54,17.88 22.54,21.11 23.96,22.53 R17.2
N$19
  Bottom 0.152: R18.2 27.54,22.37 27.54,20.95 25.48,18.89 25.48,17.94 21.83,14.29 21.83,11.19 19.13,8.49 IC5.7
N$20
  Bottom 0.152: IC5.6 19.43,9.76 21.17,11.51 21.17,14.61 24.61,18.04 24.61,20.24 26.59,22.23 R19.2
N$21  (via drill 0.35)
  Top 0.152: IC2.11 v11.51,37.47
  Bottom 0.152: IC10.6 v11.51,37.47 R21.1
N$22
  Bottom 0.152: R14.2 30.8,41.91 29.84,42.86 V.2
N$23  (via drill 0.35)
  Top 0.152: IC3.6 v19.61,26.67
  Bottom 0.152: IC9.11 v19.61,26.67 R28.1
N$24  (via drill 0.35)
  Top 0.152: IC3.5 v19.61,25.4
  Bottom 0.152: IC9.12 v19.61,25.4 R27.1
N$25  (via drill 0.35)
  Top 0.152: IC3.4 v19.61,24.13
  Bottom 0.152: IC9.13 v19.61,24.13 R26.1
N$26  (via drill 0.35)
  Top 0.152: IC3.14 11.52,22.86 v11.5,22.88
  Bottom 0.152: R32.1 11.49,22.86 v11.5,22.88 11.52,22.86 IC9.3
N$27  (via drill 0.35)
  Top 0.152: IC3.13 12.86,24.16 v11.52,24.16
  Bottom 0.152: R31.1 10.36,24.16 v11.52,24.16 12.73,24.16 IC9.4
N$28  (via drill 0.35)
  Top 0.152: IC3.12 v11.51,25.4
  Bottom 0.152: IC9.5 v11.51,25.4 R30.1
N$29  (via drill 0.35)
  Top 0.152: IC3.11 v11.51,26.67
  Bottom 0.152: IC9.6 v11.51,26.67 R29.1
N$30
  Bottom 0.305: R38.2 47.56,11.59 48.06,11.09 IC14.8 IC14.9
N$32
  Bottom 0.305: R38.1 45.45,11.84 C35.1 45.45,14.13 L3.2
OADJ
  Bottom 0.152: R35.1 84.44,3.79 SV6.3
PPS  (via drill 0.35)
  Top 0.152: v46.91,3.65 45.72,3.65 41.67,7.7 31.75,7.7 25.8,1.75 5.92,1.75 5.78,1.61 4.58,1.61 4.13,2.06 4.13,3.1 2.86,4.37 RPI.37
  Bottom 0.152: IC14.3 46.95,3.69 v46.91,3.65
PWR_SW
  Top 0.152: IC11.3 11.27,15.32 9.84,13.89 9.84,10.95 7.78,8.89 5.32,8.89 4.45,8.02 4.45,3.49 RPI.40
RST_SW
  Top 0.152: IC11.6 11.99,11.51 11.43,10.95 11.43,6.35 10.16,5.08 RPI.38
RX+
  Bottom 0.152: LAN_IN.4 71.28,41.27 72.96,39.59 72.96,25.4 arc90 73.22,25.14 73.23,25.14 arc-90 73.5,24.87 73.5,24.78 arc-90 73.23,24.52 73.22,24.52 arc90 72.96,24.26 72.96,24.17 arc90 73.22,23.91 73.23,23.91 arc-90 73.5,23.64 73.5,23.55 arc-90 73.23,23.29 73.22,23.29 arc90 72.96,23.03 72.96,22.94 arc90 73.22,22.67 73.23,22.67 arc-90 73.5,22.41 73.5,22.32 arc-90 73.23,22.06 73.22,22.06 arc90 72.96,21.8 72.96,21.71 arc90 73.22,21.44 73.23,21.44 arc-90 73.5,21.18 73.5,21.09 arc-90 73.23,20.83 73.22,20.83 arc90 72.96,20.56 72.96,20.48 arc90 73.22,20.21 73.23,20.21 arc-90 73.5,19.95 73.5,19.86 arc-90 73.23,19.6 73.22,19.6 arc90 72.96,19.33 LAN_PI.3
RX-
  Bottom 0.152: LAN_PI.6 71.91,10.13 71.91,38.97 71.04,39.85 69.22,39.85 68.34,40.72 68.34,41.99 70.17,43.81 LAN_IN.5
RXD  (via drill 0.35)
  Top 0.152: RPI.10 4.37,39.61 4.37,37.39 3.49,36.51 2.06,36.51 1.11,35.56 1.11,2.14 2.14,1.11 26.11,1.11 32.07,7.06 41.35,7.06 45.88,2.54 51.99,2.54 v52.03,2.58
  Bottom 0.152: IC14.20 55.34,5.89 v52.03,2.58
SCL
  Bottom 0.152: IC1.6 12.61,49.69 11.73,50.56 8.89,50.56 | RPI.5 2.86,46.28 3.73,47.15 6.19,47.15 6.91,47.86 6.91,50.16 7.3,50.56 8.89,50.56 | IC13.6 8.89,50.56
SCLK
  Bottom 0.152: IC4.2 11.77,15.32 10.37,16.72 5.66,21.43 4.29,21.43 RPI.23
SDA  (via drill 0.35)
  Top 0.152: RPI.3 4.45,46.67 7.54,46.67 v8.26,47.39
  Bottom 0.152: IC1.3 12.53,46.12 10.87,46.12 10.4,46.59 9.05,46.59 v8.26,47.39 7.62,48.02 IC13.5
SPD
  Bottom 0.152: IC8.13 47.94,32.31 49.61,33.97 49.61,37.54 JP8.2
SPU
  Bottom 0.152: IC8.5 46.67,20.72 47.31,20.08 JP7.2
TX+  (via drill 0.35)
  Top 0.152: LAN_IN.1 65.72,40.64 66.36,40.01 66.83,40.01 71.91,34.92 71.91,32.38 75.09,29.21 v75.25,29.21
  Bottom 0.152: v75.25,29.21 75.25,6.6 LAN_PI.1
TX-  (via drill 0.35)
  Top 0.152: LAN_IN.3 68.26,39.69 72.95,35 72.95,33.42 v73.98,32.38
  Bottom 0.152: LAN_PI.2 74.14,8.29 74.14,9.75 arc90 73.87,10.01 73.86,10.01 arc-90 73.6,10.28 73.6,10.32 arc-90 73.86,10.58 73.87,10.58 arc90 74.14,10.84 74.14,10.88 arc90 73.87,11.15 73.86,11.15 arc-90 73.6,11.41 73.6,11.45 arc-90 73.86,11.71 73.87,11.71 arc90 74.14,11.98 74.14,12.02 arc90 73.87,12.28 73.86,12.28 arc-90 73.6,12.54 73.6,12.58 arc-90 73.86,12.85 73.87,12.85 arc90 74.14,13.11 74.14,13.15 arc90 73.87,13.41 73.86,13.41 arc-90 73.6,13.68 73.6,13.72 arc-90 73.86,13.98 73.87,13.98 arc90 74.14,14.24 74.14,14.28 arc90 73.87,14.55 73.86,14.55 arc-90 73.6,14.81 73.6,14.85 arc-90 73.86,15.11 73.87,15.11 arc90 74.14,15.38 74.14,15.42 arc90 73.87,15.68 73.86,15.68 arc-90 73.6,15.94 73.6,15.98 arc-90 73.86,16.25 73.87,16.25 arc90 74.14,16.51 74.14,32.23 v73.98,32.38
TXD  (via drill 0.35)
  Top 0.152: v53.42,1.67 45.8,1.67 41.04,6.42 32.32,6.42 26.35,0.45 1.77,0.45 0.48,1.75 0.48,40.32 2.14,41.99 4.21,41.99 RPI.8
  Bottom 0.152: v53.42,1.67 53.42,2.3 55.91,4.79 IC14.21
USB_D+
  Bottom 0.152: R10.1 35.24,12.3 arc-90 40.08,17.14 39.93,17.14 arc90 44.13,21.35 IC8.7
USB_D+_TERM
  Bottom 0.152: R10.2 35.24,4.94 USB_PI.D+
USB_D-
  Bottom 0.152: IC8.6 45.4,21.27 arc46 44.75,19.75 arc-90 41.35,16.35 40.64,16.35 arc90 37.78,13.49 37.78,12.16 arc-90 37.52,11.89 37.4,11.89 arc90 37.14,11.63 37.14,10.69 arc90 37.4,10.42 37.52,10.42 arc-90 37.78,10.16 R11.1
USB_D-_TERM
  Bottom 0.152: R11.2 37.78,4.94 USB_PI.D-
V-
  Bottom 0.406: USB_TGT.4 33.65,47.45 32.52,48.58 C.1
VBUS
  Bottom 0.406: IC8.1 51.75,21.2 52.15,20.8 52.15,20.1 C8.1 52.16,17.87 50.6,16.31 45.92,16.31 44.61,15 44.61,7.14
  Bottom 0.813: USB_PI.VBUS 40.01,6.99 | 5V.2 44.61,7.14 44.61,6.99 40.01,6.99 | 40.01,6.99 39.46,6.99 39.46,9.21 | L1.P$1 39.67,11.48 39.46,11.26 39.46,9.21 | C4.1 39.46,9.21
VCC  (via drill 0.35)
  Top 0.152: v28.18,21.03 28.18,19.59 22.75,14.16 v22.75,12.62 22.72,12.62 21.92,11.82 v20.49,11.82
  Top 0.406: 46.43,43.74 v44.61,41.91 40.32,37.62 v40.32,30.16 | v52.39,43.2 51.85,43.74 46.43,43.74 | v53.34,36.83 46.43,43.74
  Bottom 0.152: IC6.9 36.19,40.13 36.84,40.79 C12.1 | C12.1 C11.1 36.83,43.51 36.83,44.45 35.72,45.56 33.81,45.56 32.37,44.12 C18.1 C17.1 32.39,43.48 IC6.8 | 44.61,40.64 42.28,40.64 C6.1 37.85,40.59 C12.1 | C13.1 18.08,13.21 IC4.8 18.26,14.05 v20.49,11.82 | IC5.8 20.34,7.22 C14.1 22.75,9.64 v22.75,12.62
  Bottom 0.305: v40.32,30.16 32.23,22.07 29.1,22.07 C37.1 29.1,20.03 29.13,20 | IC15.1 28.26,20 | 28.26,20 28.26,20.95 v28.18,21.03 | IC15.3 30.16,19.77 29.92,20 29.13,20 | 29.13,20 28.26,20
  Bottom 0.406: IC16.4 v52.39,43.2 52.7,43.51 R9.2 | v44.61,41.91 44.61,40.64 44.61,38.89 43.18,37.47 42.1,37.47 L2.P$2 | IC8.16 51.75,32.3 52.48,33.03 C19.1 53.34,34.12 v53.34,36.83
VCC/2  (via drill 0.35)
  Top 0.152: v18.41,19.05 18.35,19.11 | 18.35,19.11 IC3.1 | v18.41,30.12 18.41,31.05 IC2.1 | v21.06,18.49 20.32,19.24 20.32,28.9 v20.11,29.11 | 18.35,19.11 18.35,17.99 IC11.16 19.51,17.86 C2.1 | 22.04,30.6 22.03,30.61 v22.03,30.67 | IC11.10 18.3,10.32 21.03,10.32 21.04,10.32 21.04,10.34 21.17,10.47 21.19,10.47 21.27,10.56 22.3,10.56 26.99,15.24 v26.99,15.64
  Top 0.305: v33.73,20 34.05,20.32 34.05,21.91 32.46,23.5 TP_3V3.MP 27.94,26.04 27.94,28.26 26.67,29.53 24.39,29.53 23.31,30.6 22.04,30.6
  Bottom 0.152: C5.1 C3.1 18.55,29.99 v18.41,30.12 18.41,30.92 IC10.16 | IC9.16 18.22,19.24 v18.41,19.05 19.86,19.05 C24.1 C21.1 21.06,19.06 v21.06,18.49 | C5.1 20.95,29.84 21.75,30.64 21.75,30.88 | 21.75,30.88 21.75,31.75 21.11,32.38 21.11,38.18 20.56,38.73 20.56,43.34 | 21.31,44.74 22.07,45.5 R41.2 | R40.2 21.31,44.74 | IC1.16 20.56,43.34 | 20.56,43.34 21.25,43.34 C34.1 21.27,44.71 21.31,44.74 | C38.1 26.67,16.83 26.99,16.51 v26.99,15.64 | v20.11,29.11 20.95,29.95 C5.1 | v22.03,30.67 21.96,30.67 21.75,30.88
  Bottom 0.305: 26.67,16.83 27.91,16.83 IC15.5 29.4,17.62 31.19,17.62 33.58,20 v33.73,20
VCC_SW
  Top 0.152: USB_TGT.1
  Top 0.406: V.1 30.64,45.24 43.97,45.24 45.09,46.35 USB_TGT.1
  Bottom 0.406: USB_TGT.1 47.23,47.45 | IC16.3 49.68,45.17 47.39,47.45 47.23,47.45 | TP_VCC.MP 51.91,48.1 47.87,48.1 47.23,47.45
VDD1
  Bottom 0.152: IC8.4 IC8.3 49.21,20.72 48.83,20.34 JP7.3 49.83,18.41 50.07,18.65 C7.1
VDD2  (via drill 0.35)
  Top 0.152: v50.85,36.23 48.25,36.23 v48.22,36.25
  Bottom 0.152: IC8.14 49.21,32.45 50.86,34.1 C9.1 50.86,36.21 v50.85,36.23 | JP8.3 48.26,37.72 48.26,36.29 v48.22,36.25 48.26,36.22 48.26,34.29 46.67,32.7 IC8.12
VINA+
  Top 0.813: LAN_IN.10 81.12,37.31 81.12,27.62 79.77,26.27 73.42,26.27 70.48,29.21 POE.2
  Bottom 0.813: LAN_IN.10 81.12,45.24 81.12,50.01 83.19,52.07 SV5.1
VINA-
  Top 0.813: LAN_IN.11 76.99,38.73 79.53,36.2 79.53,28.89 78.5,27.86 74.06,27.86 70.17,31.75 POE.1
  Bottom 0.813: LAN_IN.11 76.83,38.73 82.39,44.29 82.39,48.74 83.19,49.53 SV5.2
VINB+
  Top 0.813: LAN_IN.8 74.14,41.75 74.14,44.61 74.77,45.24 80.49,45.24 82.23,46.99 SV5.3
  Bottom 0.813: LAN_IN.8 74.61,42.23 71.12,45.72 65.41,45.72 64.14,44.45 64.14,35.56 65.33,34.37 68.1,34.37 69.45,33.02 69.45,28.1 68.18,26.83 66.04,26.83 64.77,28.1 POE.4
VINB-  (via drill 0.5)
  Top 0.813: SV5.4 83.82,43.81 LAN_IN.9 | v73.1,46.28 65.96,46.28 64.14,44.45 64.14,32.38 POE.3
  Bottom 0.61: 75.56,43.81 LAN_IN.9
  Bottom 0.813: 75.56,43.81 v73.1,46.28

## Text on the board
tNames: v2.1 | 5V/IGND | D-Cube | 3V3/IGND | PoE Module
bNames: L2 | IC14 | L1